# Altium project NUC_power.PrjPcb
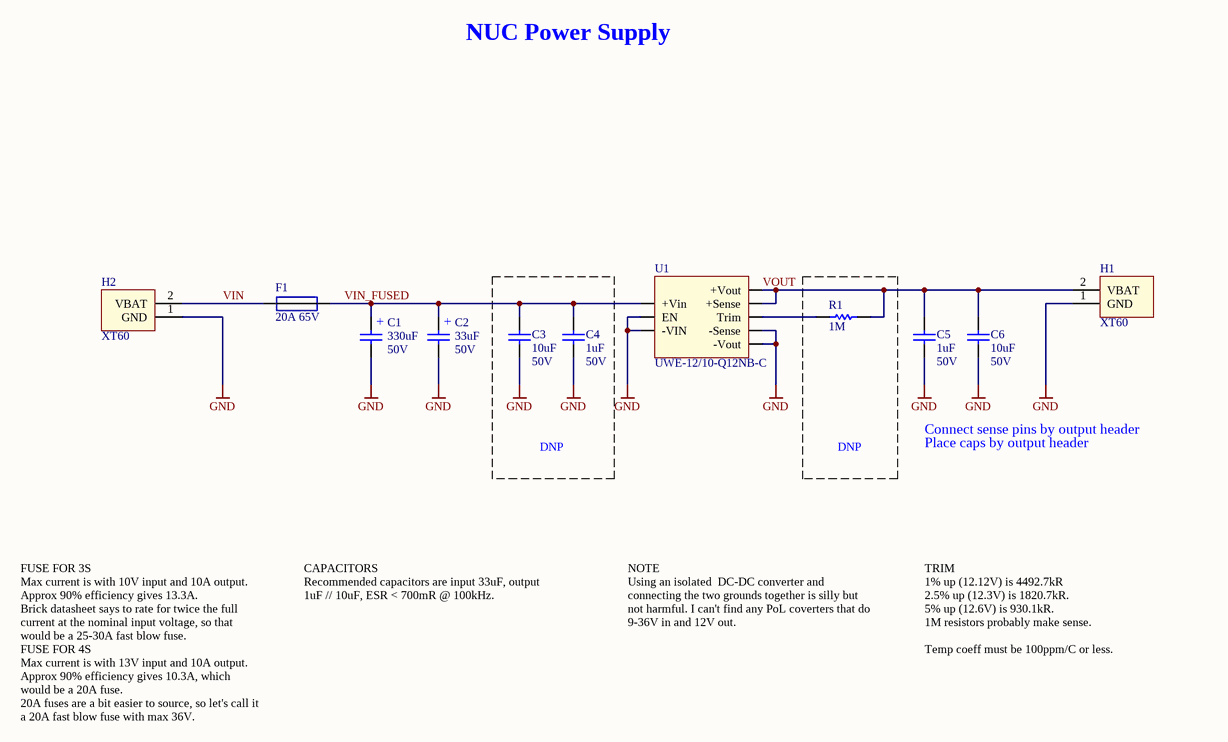
[diagram p0: NUC_power.SchDoc]
1 sheet, 11 parts. Net scope: global (net labels, ports and power ports of the same name join across sheets).
Board file: NUC_power.PcbDoc

## Sheet NUC_power.SchDoc: NUC Power Supply
size A4; DrawnBy: Matthew Edwards; Address1: ECE Department; Address2: University of Canterbury; Address3: Christchurch 8041; Address4: New Zealand; Revision: 1; SheetNumber: 1; SheetTotal: 1; PageSetup: Record=PageOptions|CenterHorizontal=True|CenterVertical=True|PrintScale=1.00|XCorrection=1.00|YCorrection=1.00|PrintKind=1|BorderSize=5000000|LeftOffset=0|BottomOffset=0|Orientation=2|PaperLength=1000|PaperWidth=1000|Scale=100|PaperSource=7|PrintQuality=-3|MediaType=1|DitherType=10|PrintScaleMode=1|PaperKind=A4 (210 x 297 mm)|PaperIndex=9

### Parts
C1  330uF  Max Voltage: 50V  [CAP_16x10]
C2  33uF  Max Voltage: 50V  [CAP_11x5]
C3  10uF  Max Voltage: 50V  [CAPC3225L]
C4  Max Voltage: 50V  [CAPC2012L]  (hidden comment: 1uF)
C5  Max Voltage: 50V  [CAPC2012L]  (hidden comment: 1uF)
C6  10uF  Max Voltage: 50V  [CAPC3225L]
F1  20A 65V  [2410_FUSE]
H1  XT60  [XT60]
H2  XT60  [XT60]
R1  1M  [RESC1608L]
U1  UWE-12/10-Q12NB-C  [MURATA_UWE-100-120W with 1/16]

### Nets
GND: C1.2 C2.2 C3.1 C4.1 C5.1 C6.1 H1.1(GND) H2.1(GND) U1.2(EN) U1.3(-VIN) U1.4(-Vout) U1.5(-Sense)
VIN: F1.0 H2.2(VBAT)
VIN_FUSED: C1.1 C2.1 C3.2 C4.2 F1.1 U1.1(+Vin)
VOUT: C5.2 C6.2 H1.2(VBAT) R1.2 U1.7(+Sense) U1.8(+Vout)
NetR1_1: R1.1 U1.6(Trim)

### Notes on the sheet
- NUC Power Supply
- DNP
- Connect sense pins by output header
- Place caps by output header
- FUSE FOR 3S
  Max current is with 10V input and 10A output. Approx 90% efficiency gives 13.3A.
  Brick datasheet says to rate for twice the full current at the nominal input voltage, so that would be a 25-30A fast blow fuse.
  FUSE FOR 4S
  Max current is with 13V input and 10A output. Approx 90% efficiency gives 10.3A, which would be a 20A fuse.
  20A fuses are a bit easier to source, so let's call it a 20A fast blow fuse with max 36V.
- CAPACITORS
  Recommended capacitors are input 33uF, output 1uF // 10uF, ESR < 700mR @ 100kHz.
- NOTE
  Using an isolated  DC-DC converter and connecting the two grounds together is silly but not harmful. I can't find any PoL coverters that do 9-36V in and 12V out.
- TRIM
  1% up (12.12V) is 4492.7kR
  2.5% up (12.3V) is 1820.7kR.
  5% up (12.6V) is 930.1kR.
  1M resistors probably make sense.
  Temp coeff must be 100ppm/C or less.
- Title
- Drawn by:
- Date:
- Time:
- Revision:
- Sheet
- of
- File:
- (in symbol CAP_TH_33U) +
- (in symbol CAP_TH_330U) +

### Library data of the parts
C1 = CAP_TH_330U: Cap TH 330uF 50V; Value: 330uF; Storage Location: ECE Store
C2 = CAP_TH_33U: Cap TH 33uF 50V; Value: 33uF; Storage Location: ECE Store
C3 C6 = CC_10uF_1210: CAP CER 10UF X7S +-10% 50V 1210; Manufacturer: Murata; Manufacturer Part Number: GCM32EC71H106KA03L; Dielectric: X7S; Footprint: 1210 (3225 metric); Supplier 1: Digikey; Supplier 1 Part Number: 490-14536-1-ND; Value: 10uF
C4 C5 = CC_1uF_0805: CAP CER 1uF X7R +-10% 50V 0805; Manufacturer: Samsung; Manufacturer Part Number: CL21B105KBFNNNG; Supplier 1: Digikey; Supplier 1 Part Number: 1276-6470-1-ND; Datasheet: http://www.samsungsem.com/kr/support/product-search/mlcc/CL21B105KBFNNNG.jsp; Value: 1uF
F1 = FUSE_20A: FUSE FAST BLOW 20A 65V 2410; Manufacturer 1: Bel Fuse Inc.; Manufacturer Part Number 1: 0679L9200-05; Supplier 1: Digi-Key; Supplier 2: Digi-Key; Supplier Part Number 1: 507-2001-1-ND; Supplier Part Number 2: F8251CT-ND; Manufacturer Part Number 2: 0451020.MRL; Manufacturer 2: Littelfuse Inc.
H1 H2 = XT60: XT60 Connector Male/Female; Manufacturer_Name: SparkFun; Manufacturer_Part_Number: PRT-10474; Geometry.Height: 15.875mm; Mouser Part Number: 474-PRT-10474; Mouser Price/Stock: https://www.mouser.com/Search/Refine.aspx?Keyword=474-PRT-10474; RS Part Number: *; RS Price/Stock: *; Datasheet Link: http://cdn.sparkfun.com/datasheets/Prototyping/xt60.pdf
R1 = RS_1M: RES 1.0M OHM 1/10W 5% 0603 SMD; Supplier: ECE Dept; Storage Location: PCB Assembly WS; Value: 1M
U1 = UWE-12/10-Q12NB-C: Isolated Module DC DC Converter 1 Output 12V 10A 9V - 36V Input; Manufacturer: Murata Power Solutions Inc.; Supplier 1: Digi-Key; ComponentLink1URL: https://power.murata.com/data/power/uwe-100-120.pdf; ComponentLink1Description: https://power.murata.com/data/power/uwe-100-120.pdf; Manufacturer Part Number: UWE-12/10-Q12NB-C; Type: Isolated Module; Voltage - Input (Min): 9V; Voltage - Input (Max): 36V; Current - Output (Max): 10A; Supplier Part Number 1: UWE-12/10-Q12NB-C-ND